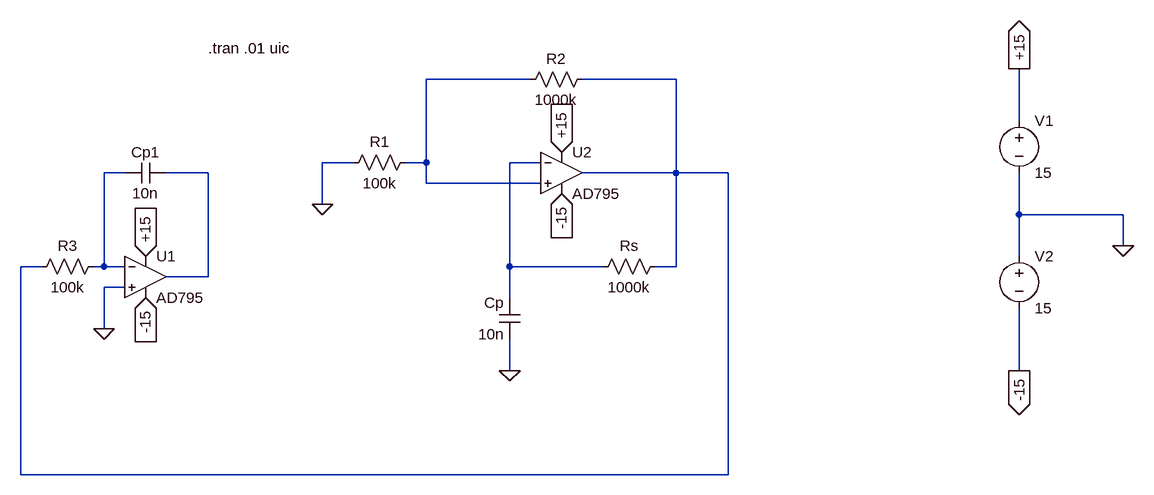
[diagram p0: schematic Multivibrador_Astavel_Triangular.asc]
Multivibrador_Astavel_Triangular.asc, the LTspice schematic file:
Version 4
SHEET 1 1076 912
WIRE 144 48 -16 48
WIRE 368 48 224 48
WIRE 896 112 896 32
WIRE -128 176 -176 176
WIRE -16 176 -16 48
WIRE -16 176 -48 176
WIRE 160 176 112 176
WIRE -480 192 -512 192
WIRE -352 192 -416 192
WIRE 368 192 368 48
WIRE 368 192 224 192
WIRE 448 192 368 192
WIRE -16 208 -16 176
WIRE 160 208 -16 208
WIRE -176 240 -176 176
WIRE 896 256 896 192
WIRE 1056 256 896 256
WIRE 1056 304 1056 256
WIRE 896 320 896 256
WIRE -608 336 -640 336
WIRE -512 336 -512 192
WIRE -512 336 -528 336
WIRE -480 336 -512 336
WIRE 112 336 112 176
WIRE 256 336 112 336
WIRE 368 336 368 192
WIRE 368 336 336 336
WIRE -352 352 -352 192
WIRE -352 352 -416 352
WIRE -480 368 -512 368
WIRE 112 384 112 336
WIRE -512 432 -512 368
WIRE 112 496 112 448
WIRE 896 496 896 400
WIRE -640 656 -640 336
WIRE 448 656 448 192
WIRE 448 656 -640 656
FLAG 112 496 0
FLAG -176 240 0
FLAG 1056 304 0
FLAG 896 32 +15
IOPIN 896 32 Out
FLAG 896 496 -15
IOPIN 896 496 Out
FLAG 192 160 +15
IOPIN 192 160 In
FLAG 192 224 -15
IOPIN 192 224 In
FLAG -448 320 +15
IOPIN -448 320 In
FLAG -448 384 -15
IOPIN -448 384 In
FLAG -512 432 0
SYMBOL res 240 32 R90
WINDOW 0 0 56 VBottom 2
WINDOW 3 32 56 VTop 2
SYMATTR InstName R2
SYMATTR Value 1000k
SYMBOL res -32 160 R90
WINDOW 0 0 56 VBottom 2
WINDOW 3 32 56 VTop 2
SYMATTR InstName R1
SYMATTR Value 100k
SYMBOL res 352 320 R90
WINDOW 0 0 56 VBottom 2
WINDOW 3 32 56 VTop 2
SYMATTR InstName Rs
SYMATTR Value 1000k
SYMBOL cap 128 448 R180
WINDOW 0 24 56 Left 2
WINDOW 3 24 8 Left 2
SYMATTR InstName Cp
SYMATTR Value 10n
SYMBOL voltage 896 96 R0
WINDOW 123 0 0 Left 2
WINDOW 39 24 124 Left 2
SYMATTR InstName V1
SYMATTR Value 15
SYMBOL voltage 896 304 R0
WINDOW 123 0 0 Left 2
WINDOW 39 0 0 Left 2
SYMATTR InstName V2
SYMATTR Value 15
SYMBOL Opamps\\AD795 192 128 R0
SYMATTR InstName U2
SYMBOL Opamps\\AD795 -448 288 R0
SYMATTR InstName U1
SYMBOL res -512 320 R90
WINDOW 0 0 56 VBottom 2
WINDOW 3 32 56 VTop 2
SYMATTR InstName R3
SYMATTR Value 100k
SYMBOL cap -480 208 R270
WINDOW 0 32 32 VTop 2
WINDOW 3 0 32 VBottom 2
SYMATTR InstName Cp1
SYMATTR Value 10n
TEXT -352 0 Left 2 !.tran .01 uic

The netlist it stands for:
* Multivibrador_Astavel_Triangular.asc
R2 N002 N001 1000k
R1 N001 0 100k
Rs N002 N003 1000k
Cp 0 N003 10n
V1 +15 0 15
V2 0 -15 15
XU2 N001 N003 +15 -15 N002 AD795  ; pins In+ In- V+ V- OUT
XU1 0 N004 +15 -15 N005 AD795  ; pins In+ In- V+ V- OUT
R3 N004 N002 100k
Cp1 N004 N005 10n
.tran .01 uic
.lib ADI1.lib
.backanno
.end